# Altium schematic sheet I2C and UART.SchDoc
size A; DocumentNumber: 10; SheetNumber: 10; SheetTotal: 13
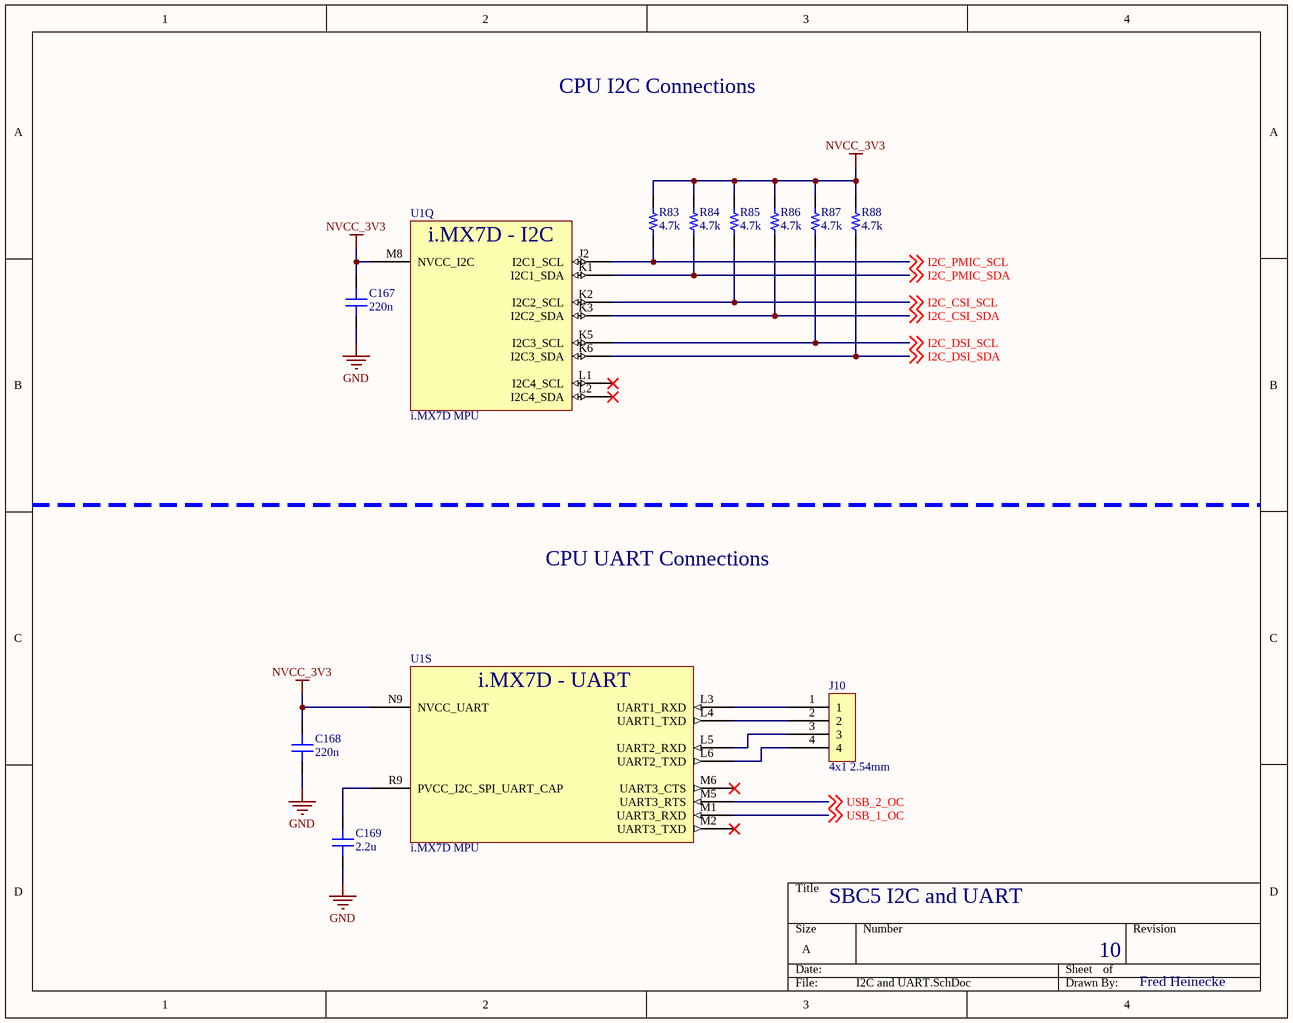
[diagram p0: I2C and UART.SchDoc]

## Parts
C167  220n  [C0201]
C168  220n  [C0201]
C169  2.2u  [C0402]
J10  4x1 2.54mm  [PH1-04-UA]
R83  4.7k  [R0201]
R84  4.7k  [R0201]
R85  4.7k  [R0201]
R86  4.7k  [R0201]
R87  4.7k  [R0201]
R88  4.7k  [R0201]
U1  i.MX7D MPU  [BGA541C75P25X25_1900X1900X140]  (parts Q,S of 23)

## Nets
GND: C167.1 C168.1 C169.1
NVCC_3V3: C167.2 C168.2 R83.2 R84.2 R85.2 R86.2 R87.2 R88.2 U1.M8(NVCC_I2C) U1.N9(NVCC_UART)
I2C_CSI_SCL: R85.1 U1.K2(I2C2_SCL) ; off-sheet I2C_CSI_SCL
I2C_CSI_SDA: R86.1 U1.K3(I2C2_SDA) ; off-sheet I2C_CSI_SDA
I2C_DSI_SCL: R87.1 U1.K5(I2C3_SCL) ; off-sheet I2C_DSI_SCL
I2C_DSI_SDA: R88.1 U1.K6(I2C3_SDA) ; off-sheet I2C_DSI_SDA
I2C_PMIC_SCL: R83.1 U1.J2(I2C1_SCL) ; off-sheet I2C_PMIC_SCL
I2C_PMIC_SDA: R84.1 U1.K1(I2C1_SDA) ; off-sheet I2C_PMIC_SDA
USB_1_OC: U1.M1(UART3_RXD) ; off-sheet USB_1_OC
USB_2_OC: U1.M5(UART3_RTS) ; off-sheet USB_2_OC
NetC169_2: C169.2 U1.R9(PVCC_I2C_SPI_UART_CAP)
NetJ10_1: J10.1 U1.L3(UART1_RXD)
NetJ10_2: J10.2 U1.L4(UART1_TXD)
NetJ10_3: J10.3 U1.L5(UART2_RXD)
NetJ10_4: J10.4 U1.L6(UART2_TXD)

Not connected (* = marked no-connect by the designer): U1 L1(I2C4_SCL)* L2(I2C4_SDA)* M2(UART3_TXD)* M6(UART3_CTS)*

## Notes on the sheet
- CPU I2C Connections
- CPU UART Connections
- SBC5 I2C and UART
- 10
- Fred Heinecke
- (in symbol MCIMX7D2DVM12SD, part Q) i.MX7D - I2C
- (in symbol MCIMX7D2DVM12SD, part S) i.MX7D - UART

## Library data of the parts
C167 C168 = GRM033R61C224KE14D: Cap Ceramic Monolithic 0.22uF 16VDC 10% SMD Paper T/R; Manufacturer: Murata; Supplier 1: Digi-Key; Manufacturer Part Number: GRM033R61C224KE14D; RoHS: No; Stock 1: 16192; Pricing 1: 1=0.10000, 10=0.03900, 50=0.02120, 100=0.01720, 500=0.01232, 1000=0.00968, 2500=0.00880, 5000=0.00810 (USD); ComponentLink1URL: https://search.murata.co.jp/Ceramy/image/img/A01X/G101/ENG/GRM033R61C224KE14-01.pdf?src-supplier=Digi-Key; ComponentLink1Description: https://search.murata.co.jp/Ceramy/image/img/A01X/G101/ENG/GRM033R61C224KE14-01.pdf?src-supplier=Digi-Key; Supplier Part Number 1: 490-17040-1-ND
C169 = LMK105BJ225MV-F: TAIYO YUDEN         LMK105BJ225MV-F            CERAMIC CAPACITOR, 2.2UF, 10V, X5R, 20%, 0402; Supplier 1: Digi-Key; Manufacturer: Taiyo Yuden; Manufacturer Part Number: LMK105BJ225MV-F; RoHS: Yes; Category: Ceramic Capacitors; Stock 1: 422093; Pricing 1: 1=0.10000, 10=0.05800, 50=0.03160, 100=0.02590, 500=0.01848, 1000=0.01452, 2500=0.01320, 5000=0.01214 (USD); Mount: Surface Mount; Case/Package: 0402; Case Code (Imperial): 0402; Case Code (Metric): 1005; Min Operating Temperature: -55°C; Max Operating Temperature: 85°C; Termination: SMD/SMT; Packaging: Tape and Reel; Capacitance: 2.2uF; Tolerance: 20%; Voltage Rating: 10V; Package Quantity: 1; Voltage Rating (DC): 10V; Dielectric: X5R; Resistor Type: Ceramic; Length: 1mm; Width: 0.5mm; Height: 0.5mm; Thickness: 0.022inch; Depth: 0.5mm; Radiation Hardening: No; Halogen Free: Halogen Free; REACH SVHC: Unknown; ComponentLink1URL: https://datasheet.ciiva.com/30190/500lmk105bj225mv-f-30190498.pdf?src-supplier=Onlinecomponents.com; ComponentLink1Description: https://datasheet.ciiva.com/30190/500lmk105bj225mv-f-30190498.pdf?src-supplier=Onlinecomponents.com; ComponentLink2URL: https://datasheet.ciiva.com/23631/lmk105bj225mv-f-ss-23631491.pdf?src-supplier=Newark; ComponentLink2Description: https://datasheet.ciiva.com/23631/lmk105bj225mv-f-ss-23631491.pdf?src-supplier=Newark; ComponentLink3URL: https://datasheet.ciiva.com/134/lmk105bj225mv-f-ss-134677.pdf?src-supplier=Digi-Key; ComponentLink3Description: https://datasheet.ciiva.com/134/lmk105bj225mv-f-ss-134677.pdf?src-supplier=Digi-Key; ComponentLink4URL: https://datasheet.ciiva.com/15921/286lmk105bj225mv-f-15921222.pdf?src-supplier=Onlinecomponents.com; ComponentLink4Description: https://datasheet.ciiva.com/15921/286lmk105bj225mv-f-15921222.pdf?src-supplier=Onlinecomponents.com; Supplier Part Number 1: 587-3153-1-ND
J10 = PH1-04-UA: Conn Unshrouded Header HDR 4 POS 2.54mm Solder ST Thru-Hole Bag; Manufacturer: Adam Equipment; Number of Positions: 4; Supplier 1: Digi-Key; Supplier Part Number 1: 2057-PH1-04-UA-ND; Manufacturer Part Number: PH1-04-UA; RoHS: Yes; Category: Connectors; Stock 1: 1152; Pricing 1: 1=0.10000, 10=0.07200, 100=0.04440, 500=0.03672, 1000=0.03213, 5000=0.02754, 10000=0.02678 (USD); Termination: Through Hole; Pitch: 2.54mm; Lead Free: Lead Free; ComponentLink1URL: http://www.adam-tech.com/catalog/2010/page_292-295.pdf?src-supplier=Future+Electronics; ComponentLink1Description: http://www.adam-tech.com/catalog/2010/page_292-295.pdf?src-supplier=Future+Electronics; ComponentLink2Description: Datasheet; ComponentLink2URL: https://static6.arrow.com/aropdfconversion/683efa088b5c0b1a8da3df70e12f05ed3743b8bf/page_292.pdf; ComponentLink3Description: Mechanical drawing; ComponentLink3URL: http://www.adam-tech.com/upload/PH1-XX-UA.pdf
R83-R88 = RC0201FR-074K7L: GENERAL 0201 11% REEL (7INCH); Manufacturer: Yageo; Resistance: 4.7kR; Tolerance: 1%; Temperature Coefficient: 200ppm/°C; Power Rating: 50mW; Voltage Rating: 25V; Supplier 1: Digi-Key; Supplier Part Number 1: 311-4.70KMCT-ND; Manufacturer Part Number: RC0201FR-074K7L; RoHS: Yes; Category: Chip SMD Resistors; Stock 1: 1942576; Pricing 1: 1=0.10000, 10=0.03600, 100=0.01480, 1000=0.00665, 2500=0.00577, 5000=0.00477 (USD); Case/Package: 0201; Contact Plating: Tin,Matte; Case Code (Metric): 0603; Case Code (Imperial): 0201; Weight: 6E-06oz; Size Code: 0201; Min Operating Temperature: -55°C; Max Operating Temperature: 125°C; Resistor Type: Thick Film; Packaging: Tape and Reel; Package Quantity: 1; Number of Terminations: 2; Termination: SMD/SMT; Max Power Dissipation: 50mW; Features: Moisture Resistant; Series: RC; Resistance Tolerance: 1%; Construction: Rectangular; Length: 0.6mm; Width: 0.012inch; Height: 0.01inch; Depth: 0.3mm; Radiation Hardening: No; REACH SVHC: Unknown; Military Standard: Not; Lead Free: Lead Free; RoHS Compliant: Yes; ComponentLink1URL: https://datasheet.ciiva.com/2493/pyu-r-int-thick-7-2493811.pdf?src-supplier=Digi-Key; ComponentLink1Description: https://datasheet.ciiva.com/2493/pyu-r-int-thick-7-2493811.pdf?src-supplier=Digi-Key; ComponentLink2URL: https://datasheet.ciiva.com/2493/pyu-r-int-thick-7-2493812.pdf?src-supplier=Digi-Key; ComponentLink2Description: https://datasheet.ciiva.com/2493/pyu-r-int-thick-7-2493812.pdf?src-supplier=Digi-Key; ComponentLink3URL: https://datasheet.ciiva.com/2493/pyu-r-int-thick-7-2493813.pdf?src-supplier=Digi-Key; ComponentLink3Description: https://datasheet.ciiva.com/2493/pyu-r-int-thick-7-2493813.pdf?src-supplier=Digi-Key; ComponentLink4URL: https://datasheet.ciiva.com/7672/1563626-7672233.pdf?src-supplier=Element14; ComponentLink4Description: https://datasheet.ciiva.com/7672/1563626-7672233.pdf?src-supplier=Element14; ComponentLink5URL: https://datasheet.ciiva.com/28410/pyu-rc0201-51-rohs-l-8-28410061.pdf?src-supplier=Avnet+Europe; ComponentLink5Description: https://datasheet.ciiva.com/28410/pyu-rc0201-51-rohs-l-8-28410061.pdf?src-supplier=Avnet+Europe; ComponentLink6URL: https://datasheet.ciiva.com/8892/pyu-rc0201-51-rohs-l-8-8892942.pdf?src-supplier=Avnet; ComponentLink6Description: https://datasheet.ciiva.com/8892/pyu-rc0201-51-rohs-l-8-8892942.pdf?src-supplier=Avnet
U1 = MCIMX7D2DVM12SD: Heterogeneous Multicore Processing Architecture; Manufacturer: NXP Freescale; Manufacturer Part Number: MCIMX7D2DVM12SD; Stock 1: 0; Pricing 1: 168=18.42238 (USD); ComponentLink1Description: Datasheet; ComponentLink1URL: https://www.nxp.com/docs/en/data-sheet/IMX7DCEC.pdf; ComponentLink2Description: Reference manual; ComponentLink2URL: https://www.nxp.com/docs/en/reference-manual/IMX7DRM.pdf; ComponentLink3Description: Hardware Development Guide; ComponentLink3URL: https://www.nxp.com/docs/en/user-guide/IMX7DSHDG.pdf; Supplier 1: Digi-Key; Supplier Part Number 1: 568-15401-ND